# EasyEDA Pro project Complete_project.epro, schematic Schematic2

## Sheets
1 电机: Board Name: control; Create Date: 2024-11-13; Page Name: 电机; Project Name: 煮茶机; Schematic Name: Schematic2; Update Date: 2024-12-08; Company: 嘉立创EDA; Page Size: A4; Version: V1.0
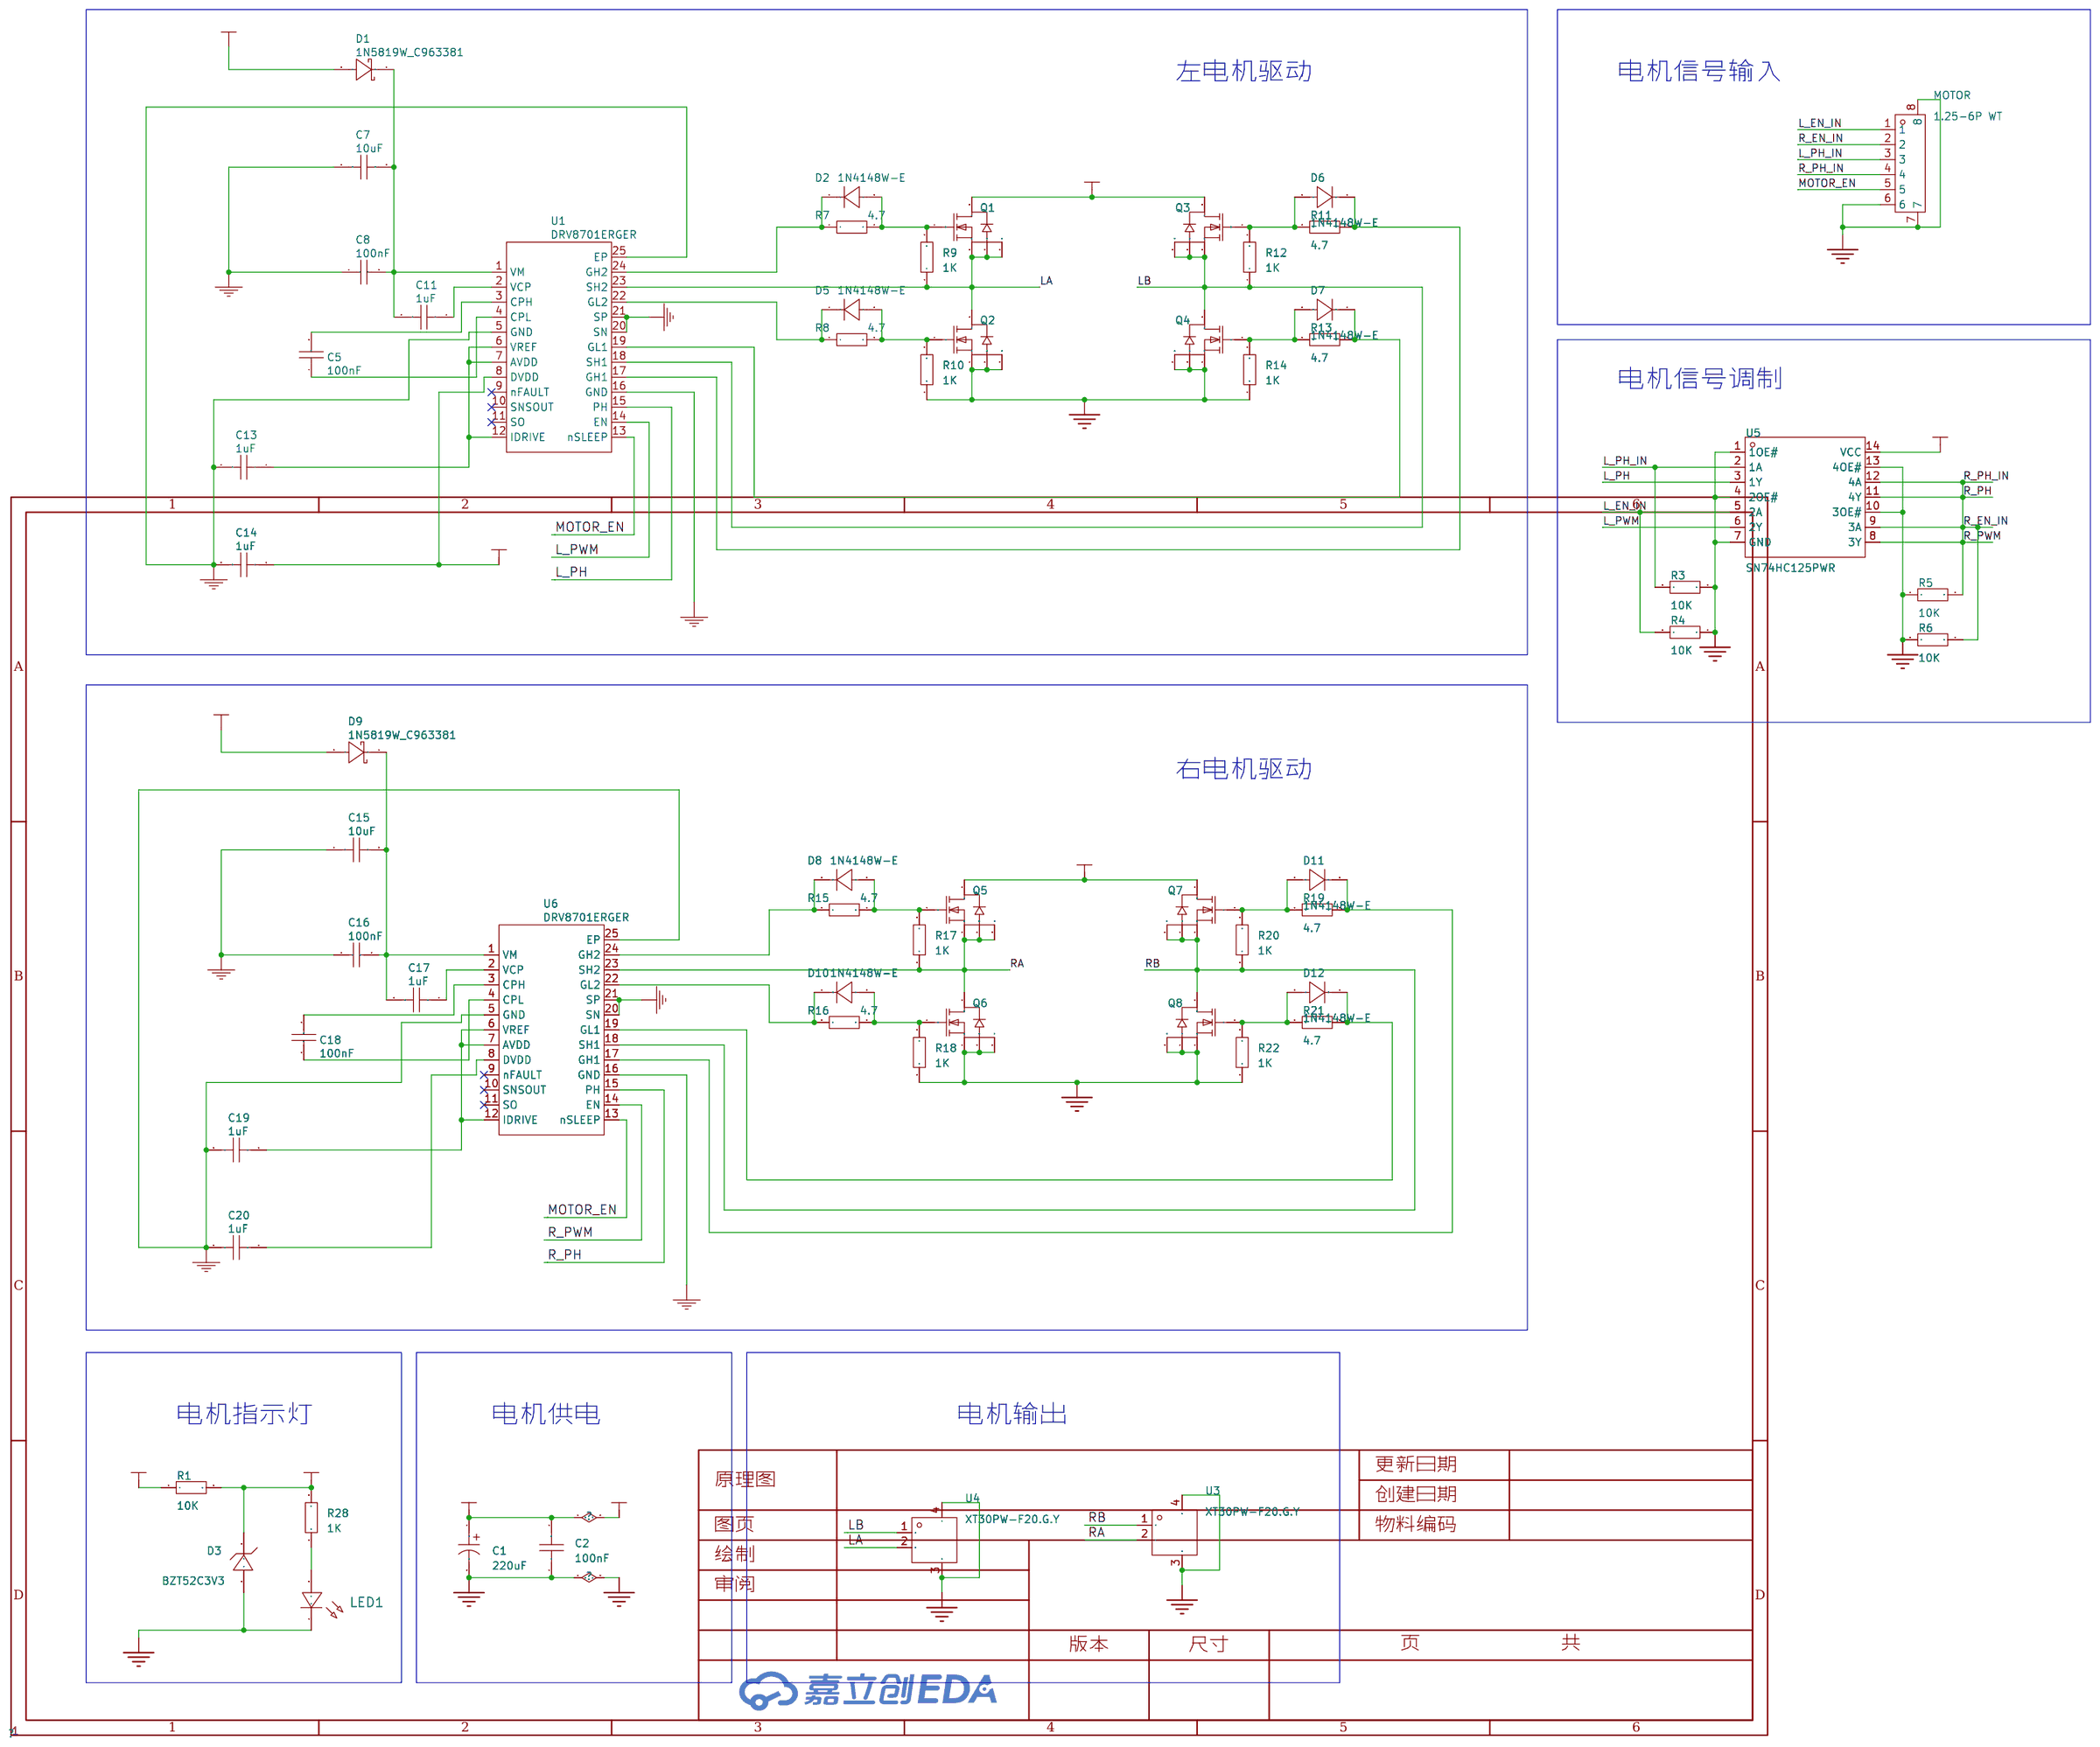
[diagram p2: 电机]
2 其他控制: Create Date: 2024-12-05; Page Name: 其他控制
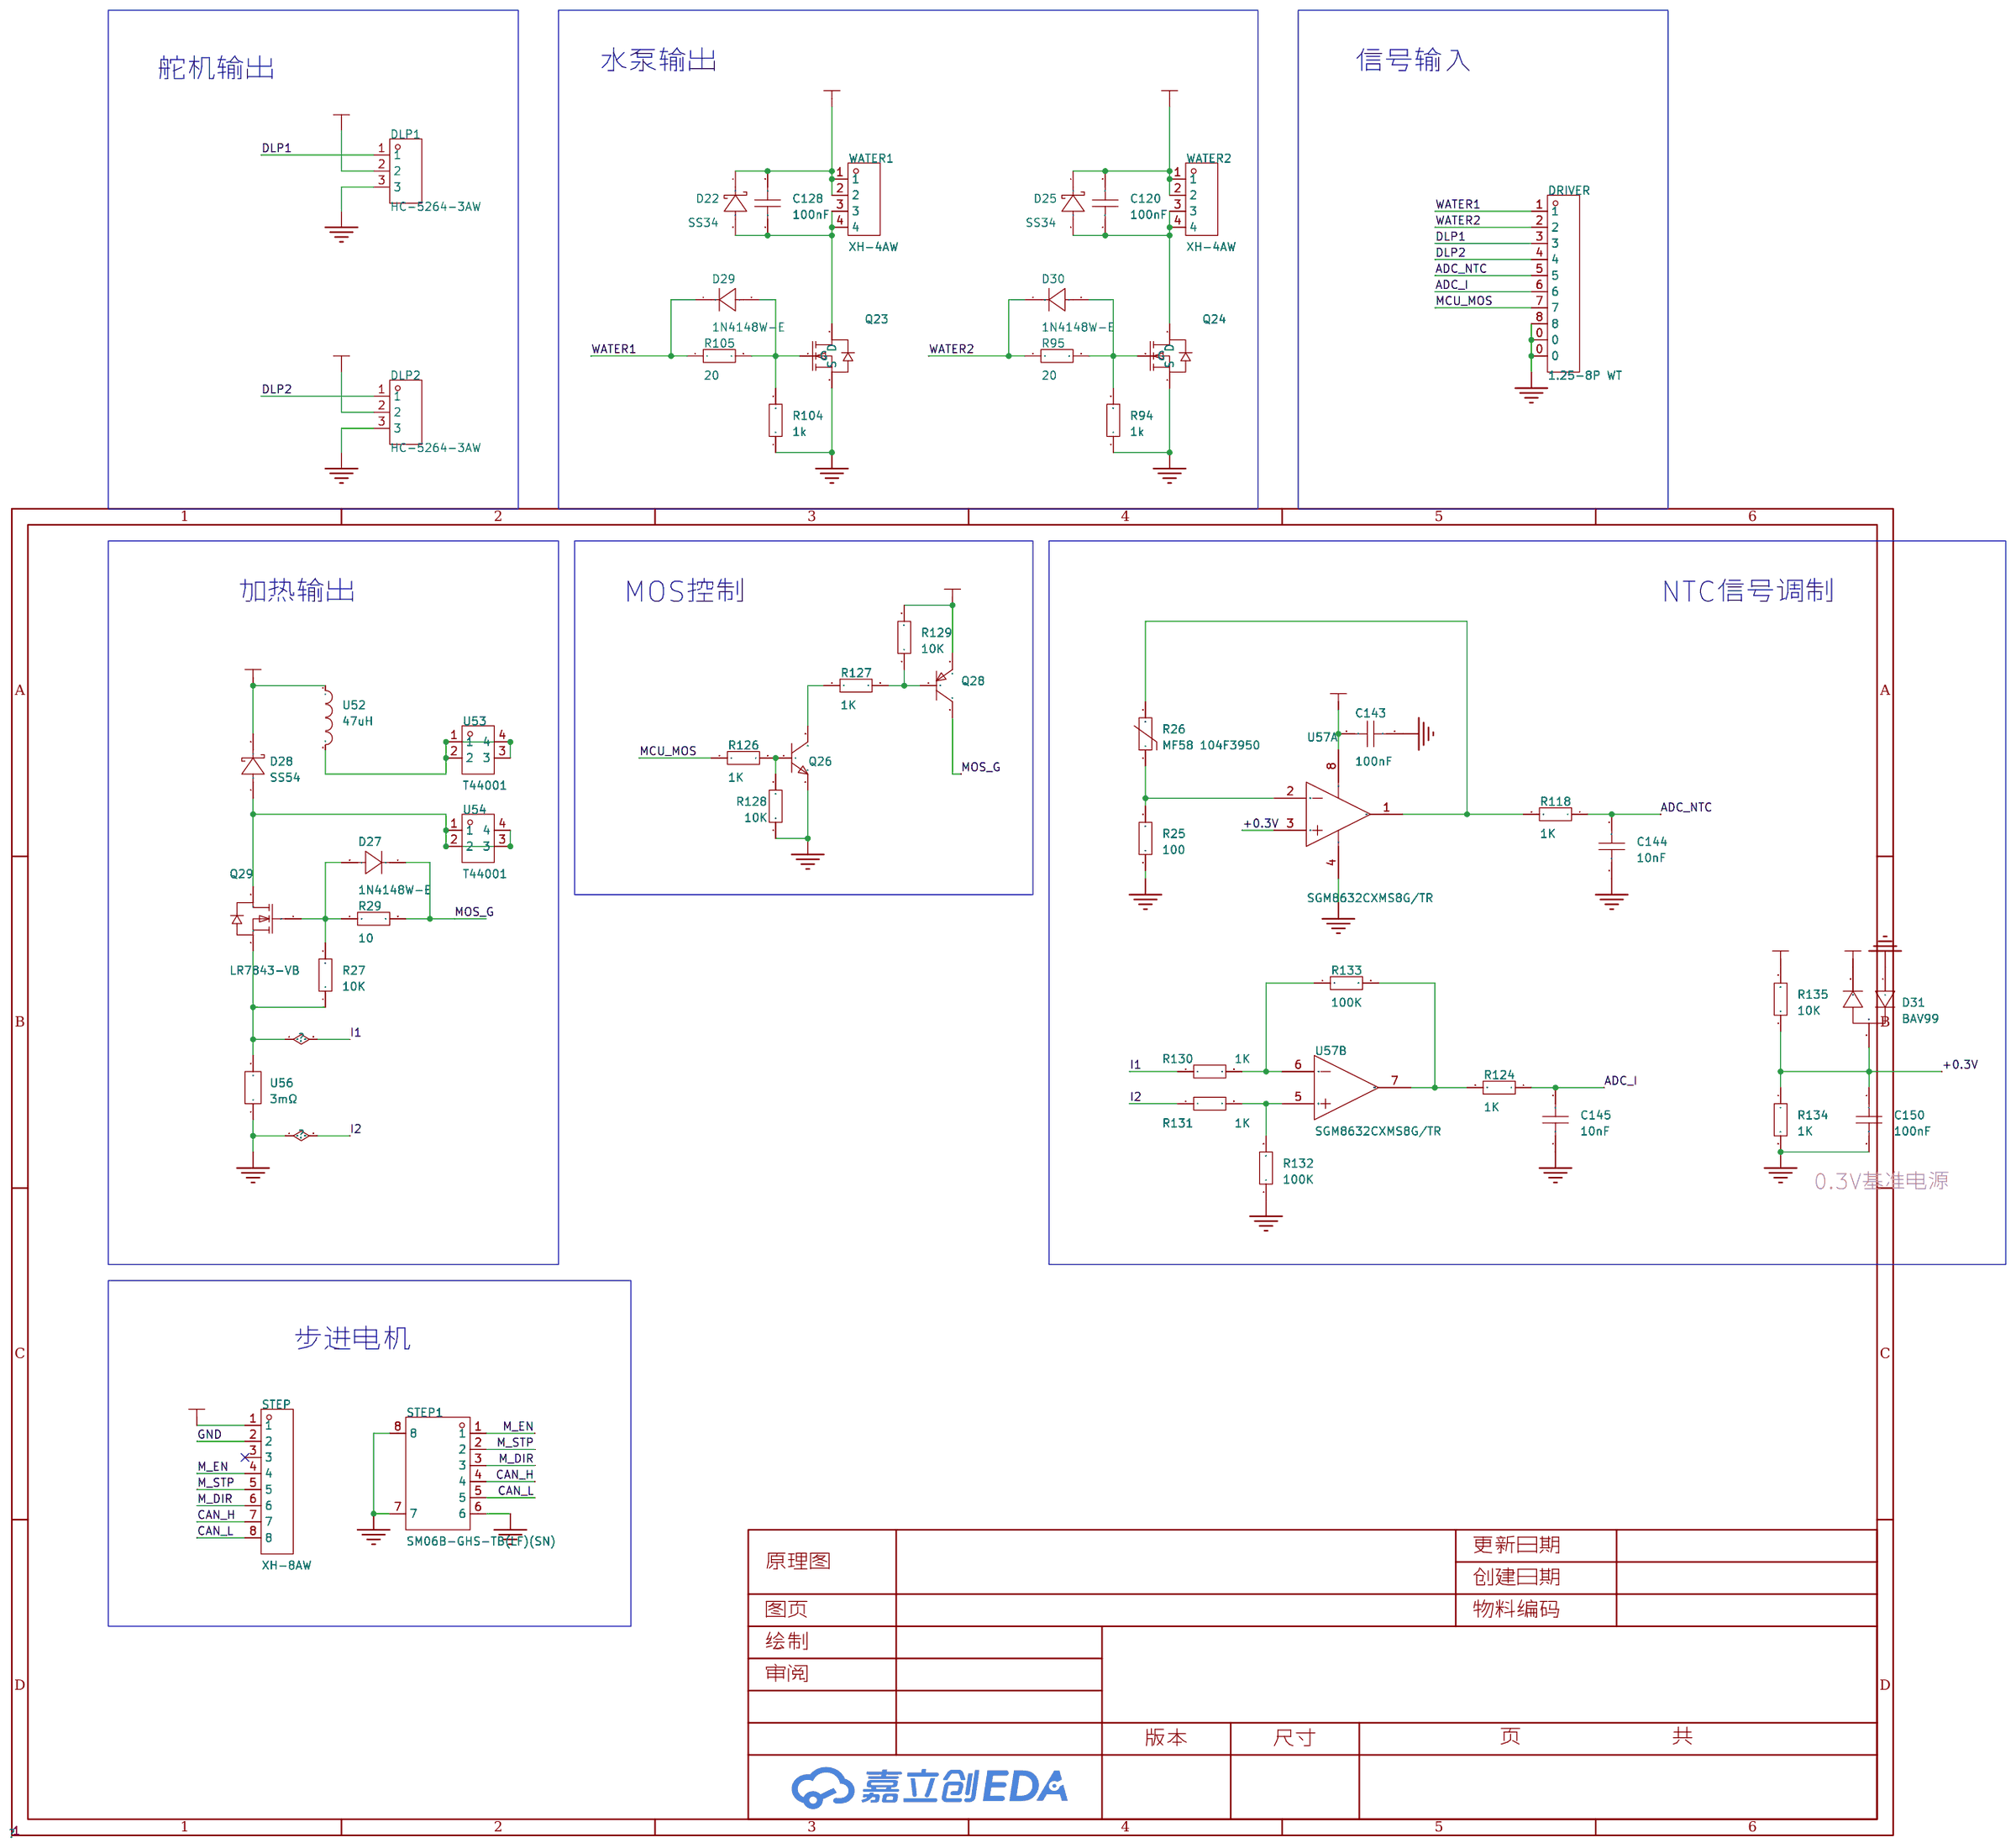
[diagram p3: 其他控制]
3 电源管理: Create Date: 2024-12-05; Page Name: 电源管理; Update Date: 2025-02-22
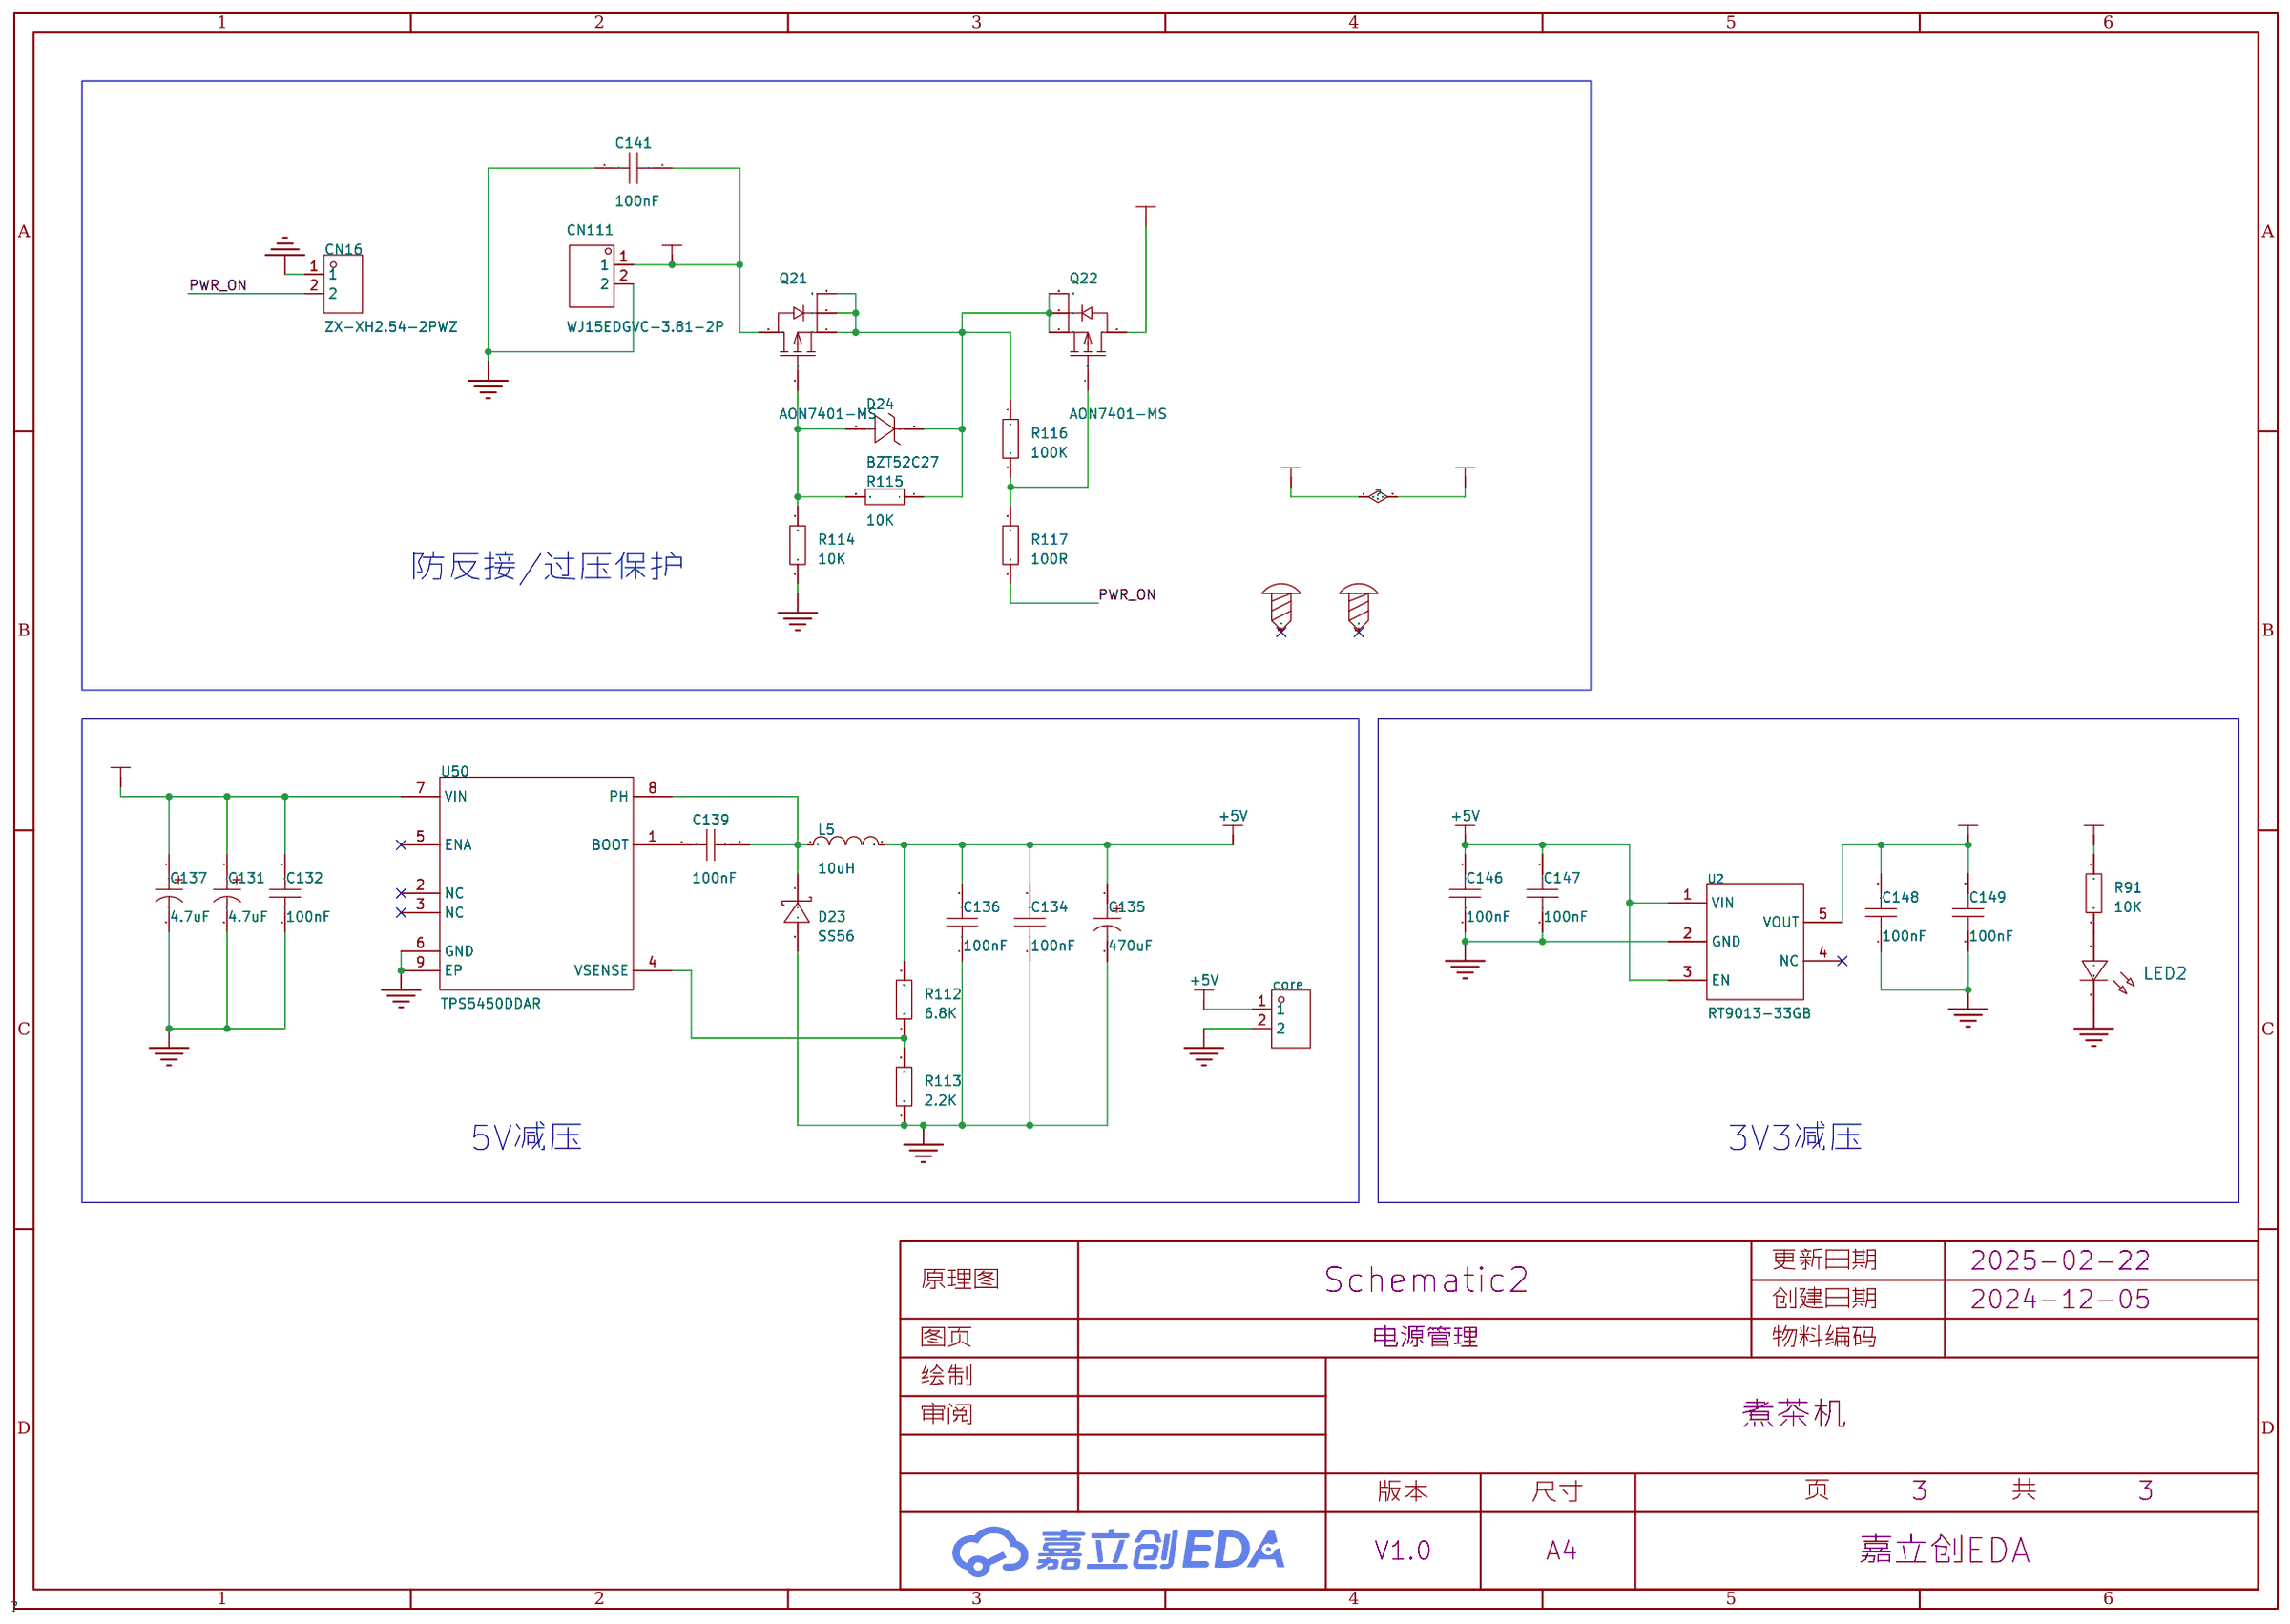
[diagram p4: 电源管理]

## Parts
sheet 其他控制
C120  100nF  [C0805]
C128  100nF  [C0805]
C143  100nF  [C0805]
C144  10nF  [C0805]
C145  10nF  [C0805]
C150  100nF  [C0805]
D22  SS34  [SMA_L4.3-W2.5-LS5.0-RD]
D25  SS34  [SMA_L4.3-W2.5-LS5.0-RD]
D27  1N4148W-E  [SOD-123_L2.8-W1.6-LS3.7-RD]
D28  SS54  [SMA_L4.3-W2.6-LS5.0-FD]
D29  1N4148W-E  [SOD-123_L2.8-W1.6-LS3.7-RD]
D30  1N4148W-E  [SOD-123_L2.8-W1.6-LS3.7-RD]
D31  BAV99  [SOT-23_L2.9-W1.3-P1.90-LS2.4-BR]
DLP1  HC-5264-3AW  [CONN-TH_3P-P2.50_HCTL_HC-5264-3AW]
DLP2  HC-5264-3AW  [CONN-TH_3P-P2.50_HCTL_HC-5264-3AW]
DRIVER  1.25-8P WT  [CONN-SMD_8P-P1.25-L4.4-W14.8]
Q23  -  [SOT-23-3_L2.9-W1.3-P1.90-LS2.4-BR]
Q24  -  [SOT-23-3_L2.9-W1.3-P1.90-LS2.4-BR]
Q26  -  [S8050_SOT-23]
Q28  -  [S8550P_SOT]
Q29  LR7843-VB  [TO-252-2_L6.6-W6.1-P4.58-LS9.9-BR]
R25  100  [R0805]
R26  MF58 104F3950  [RES-TH_BD2.5-L4.7-P8.70-D0.5]
R27  10K  [R0805]
R29  10  [R0805]
R94  1k  [R0805]
R95  20  [R0805]
R104  1k  [R0805]
R105  20  [R0805]
R118  1K  [R0805]
R124  1K  [R0805]
R126  1K  [R0805]
R127  1K  [R0805]
R128  10K  [R0805]
R129  10K  [R0805]
R130  1K  [R0805]
R131  1K  [R0805]
R132  100K  [R0805]
R133  100K  [R0805]
R134  1K  [R0805]
R135  10K  [R0805]
STEP  XH-8AW  [CONN-TH_8P-P2.54_HCTL_XH-8AW_C2908617]
STEP1  SM06B-GHS-TB(LF)(SN)  [CONN-TH_SM06B-GHS-TB-LF-SN]
U52  47uH  [IND-TH_L16.5-W8.5-P11.00-D1.0]
U53  T44001  [CONN-TH_T44001]
U54  T44001  [CONN-TH_T44001]
U56  3mΩ  [R2512]
U57  SGM8632CXMS8G/TR  [MSOP-8_L3.0-W3.0-P0.65-LS4.9-BL]  (sections 1,2)
WATER1  XH-4AW  [CONN-TH_XH-4AW]
WATER2  XH-4AW  [CONN-TH_XH-4AW]
sheet 电机
C1  220uF  [CAP-TH_BD6.3-P2.50-D1.0-FD]
C2  100nF  [C0805]
C5  100nF  [C0603]
C7  10uF  [C0603]
C8  100nF  [C0603]
C11  1uF  [C0603]
C13  1uF  [C0603]
C14  1uF  [C0603]
C15  10uF  [C0603]
C16  100nF  [C0603]
C17  1uF  [C0603]
C18  100nF  [C0603]
C19  1uF  [C0603]
C20  1uF  [C0603]
D1  1N5819W_C963381  [SOD-123_L2.7-W1.6-LS3.7-RD]
D2  1N4148W-E  [SOD-123_L2.8-W1.6-LS3.7-RD]
D3  BZT52C3V3  [SOD-123_L2.7-W1.6-LS3.7-RD]
D5  1N4148W-E  [SOD-123_L2.8-W1.6-LS3.7-RD]
D6  1N4148W-E  [SOD-123_L2.8-W1.6-LS3.7-RD]
D7  1N4148W-E  [SOD-123_L2.8-W1.6-LS3.7-RD]
D8  1N4148W-E  [SOD-123_L2.8-W1.6-LS3.7-RD]
D9  1N5819W_C963381  [SOD-123_L2.7-W1.6-LS3.7-RD]
D10  1N4148W-E  [SOD-123_L2.8-W1.6-LS3.7-RD]
D11  1N4148W-E  [SOD-123_L2.8-W1.6-LS3.7-RD]
D12  1N4148W-E  [SOD-123_L2.8-W1.6-LS3.7-RD]
LED1  -  [LED_0805]
MOTOR  1.25-6P WT  [CONN-SMD_1.25-6PWT]
Q1  CSD18540Q5B(TOKMAS)  [TDSON-8_L5.9-W5.2-P1.27-BL]
Q2  CSD18540Q5B(TOKMAS)  [TDSON-8_L5.9-W5.2-P1.27-BL]
Q3  CSD18540Q5B(TOKMAS)  [TDSON-8_L5.9-W5.2-P1.27-BL]
Q4  CSD18540Q5B(TOKMAS)  [TDSON-8_L5.9-W5.2-P1.27-BL]
Q5  CSD18540Q5B(TOKMAS)  [TDSON-8_L5.9-W5.2-P1.27-BL]
Q6  CSD18540Q5B(TOKMAS)  [TDSON-8_L5.9-W5.2-P1.27-BL]
Q7  CSD18540Q5B(TOKMAS)  [TDSON-8_L5.9-W5.2-P1.27-BL]
Q8  CSD18540Q5B(TOKMAS)  [TDSON-8_L5.9-W5.2-P1.27-BL]
R1  10K  [R0805]
R3  10K  [R0805]
R4  10K  [R0805]
R5  10K  [R0805]
R6  10K  [R0805]
R7  4.7  [R0805]
R8  4.7  [R0805]
R9  1K  [R0805]
R10  1K  [R0805]
R11  4.7  [R0805]
R12  1K  [R0805]
R13  4.7  [R0805]
R14  1K  [R0805]
R15  4.7  [R0805]
R16  4.7  [R0805]
R17  1K  [R0805]
R18  1K  [R0805]
R19  4.7  [R0805]
R20  1K  [R0805]
R21  4.7  [R0805]
R22  1K  [R0805]
R28  1K  [R0805]
U1  DRV8701ERGER  [VQFN-24_L4.0-W4.0-P0.50-BL-EP2.8]
U3  XT30PW-F20.G.Y  [CONN-TH_XT30PW-F-1]
U4  XT30PW-F20.G.Y  [CONN-TH_XT30PW-F-1]
U5  SN74HC125PWR  [TSSOP-14_L5.0-W4.4-P0.65-LS6.5-BL]
U6  DRV8701ERGER  [VQFN-24_L4.0-W4.0-P0.50-BL-EP2.8]
sheet 电源管理
C131  4.7uF  [CAP-SMD_BD4.0-L4.3-W4.3-LS5.0-FD]
C132  100nF  [C0805]
C134  100nF  [C0805]
C135  470uF  [CAP-SMD_BD10.0-L10.3-W10.3-LS11.3-FD]
C136  100nF  [C0805]
C137  4.7uF  [CAP-SMD_BD4.0-L4.3-W4.3-LS5.0-FD]
C139  100nF  [C0805]
C141  100nF  [C1210]
C146  100nF  [C0805]
C147  100nF  [C0805]
C148  100nF  [C0805]
C149  100nF  [C0805]
CN16  ZX-XH2.54-2PWZ  [CONN-TH_2P-P2.50_ZX-XH2.54-2PWZ]
CN111  WJ15EDGVC-3.81-2P  [CONN-TH_WJ15EDGVC-3.81-2P]
core  ZX-XH2.54-2PWZ  [CONN-TH_2P-P2.50_ZX-XH2.54-2PWZ]
D23  SS56  [SMA_L4.3-W2.6-LS5.2-RD]
D24  BZT52C27  [SOD-123_L2.7-W1.6-LS3.7-RD]
L5  10uH  [IND-SMD_L7.3-W6.8]
LED2  -  [LED_0805]
Q21  AON7401-MS  [POWERDI3333-8_DMN7022LFGQ-7]
Q22  AON7401-MS  [POWERDI3333-8_DMN7022LFGQ-7]
R91  10K  [R0805]
R112  6.8K  [R0805]
R113  2.2K  [R0805]
R114  10K  [R0805]
R115  10K  [R0805]
R116  100K  [R0805]
R117  100R  [R0805]
SCREW1  -  [M3螺丝]
SCREW2  -  [M3螺丝]
U2  RT9013-33GB  [SOT-23-5_L3.0-W1.7-P0.95-LS2.8-BL]
U50  TPS5450DDAR  [SOP-8_L4.9-W3.9-P1.27-LS6.0-BL-EP]

## Library data of the parts
C2 C120 C128 C132 C134 C136 C139 C141 C143-C150 = CAP_0805: Supplier Footprint: 0805
D22 D25 = SS34_C727060: 二极管配置:独立式;正向压降(Vf):550mV@3A;直流反向耐压(Vr):40V;平均整流电流(Io):3A;; LCSC Part Name: 电压:40V 电流:3A; Supplier Part: C727060; Manufacturer: TWGMC(台湾迪嘉); Supplier Footprint: SMA(DO-214AC); JLCPCB Part Class: 扩展库; Datasheet: https://atta.szlcsc.com/upload/public/pdf/source/20200828/C727059_6599B6CAC5F3238B9C33E46794659DBE.pdf; Supplier: LCSC; Diode Configuration: 独立式; Forward Voltage (Vf@If): 550mV@3A; Reverse Voltage (Vr): 40V; Average Rectified Current (Io): 3A; Reverse Leakage Current (Ir): 500uA@40V
D2 D5-D8 D10-D12 D27 D29 D30 = 1N4148W-E: 二极管配置:-;正向压降(Vf):-;直流反向耐压(Vr):-;; LCSC Part Name: 开关二极管; Supplier Part: C41371420; Manufacturer: MDD(辰达半导体); Supplier Footprint: SOD-123; JLCPCB Part Class: 扩展库; Datasheet: https://atta.szlcsc.com/upload/public/pdf/source/20240830/DACFAB1CEFECD76C0C0B0085B83E27DC.pdf; Supplier: LCSC
D28 = SS54_C7420369: 二极管配置:独立式;正向压降(Vf):550mV@5.0A;直流反向耐压(Vr):40V;整流电流:5A;; LCSC Part Name: 电压:40V 电流:5A; Supplier Part: C7420369; Manufacturer: 宏迦橙; Supplier Footprint: SMA(DO-214AC); JLCPCB Part Class: 扩展库; Datasheet: https://atta.szlcsc.com/upload/public/pdf/source/20230828/254C3882F8647358AD9F60DD73611B5E.pdf; Supplier: LCSC; Diode Configuration: 独立式; Forward Voltage (Vf@If): 550mV@5.0A; Reverse Voltage (Vr): 40V; Rectified Current: 5A; Reverse Leakage Current (Ir): 50uA@40V
D31 = BAV99_C408392: 二极管配置:1对串联式;正向压降(Vf):1.25V@150mA;直流反向耐压(Vr):70V;整流电流:200mA;反向恢复时间(trr):6ns;; LCSC Part Name: 电压:70V 电流:200mA; Supplier Part: C408392; Manufacturer: MDD(辰达半导体); Supplier Footprint: SOT-23; JLCPCB Part Class: 扩展库; Datasheet: https://atta.szlcsc.com/upload/public/pdf/source/20240710/712A41600A6652723ABF2FD56C16FE3C.pdf; Supplier: LCSC; Diode Configuration: 1对串联式; Forward Voltage (Vf@If): 1.25V@150mA; Reverse Voltage (Vr): 70V; Rectified Current: 200mA; Reverse Leakage Current: 2.5uA@70V; Reverse Recovery Time (trr): 6ns
DLP1 DLP2 = HC-5264-3AW: 插针结构:1x3P;间距:2.5mm;安装方式:弯插;参考系列:-;总PIN数:3P;排数:1;每排PIN数:3;行距:-;额定电流:3A;触头材质:黄铜;触头镀层:锡;工作温度范围:-25℃~+85℃;; LCSC Part Name: 1x3P 间距:2.5mm 弯插; Supplier Part: C2845826; Manufacturer: HCTL(华灿天禄); Supplier Footprint: 弯插,P=2.5mm; JLCPCB Part Class: 扩展库; Datasheet: https://atta.szlcsc.com/upload/public/pdf/source/20231019/7C36622803850C43F3C11A8612AA539D.pdf; Supplier: LCSC; Pins Structure: 1x3P; Pitch: 2.5mm; Mounting Style: 弯插; Number of Pins: 3P; Number of Rows: 1; Number of PINs Per Row: 3; Current Rating (Max): 3A; Contact Material: 黄铜; Contact Plating: 锡; Operating Temperature Range: -25℃~+85℃
DRIVER = 1.25-8P WT: 插针结构:1x8P;间距:1.25mm;安装方式:卧贴;参考系列:-;总PIN数:8P;排数:1;每排PIN数:8;行距:-;额定电流:-;工作温度范围:-40℃~+85℃;; Supplier Part: C2681529; Manufacturer: SHOU HAN(首韩); Supplier Footprint: SMD,P=1.25mm,卧贴; JLCPCB Part Class: 扩展库; Datasheet: https://atta.szlcsc.com/upload/public/pdf/source/20210107/C2681529_22D70B53821B9BA4D70344DBAB526F9C.pdf; Supplier: LCSC; Pins Structure: 1x8P; Pitch: 1.25mm; Mounting Style: 卧贴; Number of Pins: 8P; Number of Rows: 1; Number of PINs Per Row: 8; Operating Temperature Range: -40℃~+85℃
Q23 Q24 = AO3400A_N: 类型:N沟道;漏源电压(Vdss):30V;连续漏极电流(Id):5.2A;功率(Pd):1W;导通电阻(RDS(on)@Vgs,Id):35mΩ@10V,5A;阈值电压(Vgs(th)@Id):1.5V@250μA;; Supplier Footprint: SOT-23; Supplier Part: C700953
Q26 = S8050_SOT_NPN: Supplier Footprint: SOT-23
Q28 = S8550_SOT_PNP: Supplier Footprint: SOT-23
Q29 = LR7843-VB: 类型:1个N沟道;漏源电压(Vdss):30V;连续漏极电流(Id):35.8A;导通电阻(RDS(on)@Vgs,Id):2.3mΩ@10V,38.8A;功率(Pd):3.75W;阈值电压(Vgs(th)@Id):1.5V@250uA;; LCSC Part Name: 1个N沟道 耐压:30V 电流:120A; Supplier Part: C5137375; Manufacturer: VBsemi(微碧半导体); Supplier Footprint: TO-252; JLCPCB Part Class: 扩展库; Datasheet: https://atta.szlcsc.com/upload/public/pdf/source/20240814/AEBBAF20133735F24F8E0E251780DEE5.pdf; Supplier: LCSC; Type: 1个N沟道; Drain Source Voltage (Vdss): 30V; Continuous Drain Current (Id): 35.8A; Drain Source On Resistance (RDS(on)@Vgs,Id): 2.3mΩ@10V,38.8A; Power Dissipation (Pd): 3.75W; Gate Threshold Voltage (Vgs(th)@Id): 1.5V@250uA; Total Gate Charge (Qg@Vgs): 81.5nC@10V; Input Capacitance (Ciss@Vds): 6.201nF@15V; Reverse Transfer Capacitance (Crss@Vds): 970pF@15V; Operating Temperature: -55℃~+175℃
R1 R3-R22 R25 R27 R29 R91 R94 R95 R104 R105 R112-R118 R124 R126-R135 = Res_0805: Supplier Footprint: 0805
R26 = MF58 104F3950: 阻值(25℃):100kΩ;B值(25℃/50℃):3950K;电阻精度:±1%;功率:50mW;B值精度:±1%;最大稳态电流(25℃):-;; LCSC Part Name: 100kΩ 电阻精度:±1% 3950K; Supplier Part: C123399; Manufacturer: 时恒; Supplier Footprint: 插件,D1.8xL4mm; JLCPCB Part Class: 扩展库; Datasheet: https://atta.szlcsc.com/upload/public/pdf/source/20170728/C123399_1501225831676848963.pdf; Supplier: LCSC; Resistance @ 25℃: 100kΩ; B Constant (25℃/50℃): 3950K; Resistance Tolerance: ±1%; Power: 50mW; B Constant Tolerance: ±1%; Operating Temperature: -55℃~+250℃
STEP = XH-8AW: 插针结构:1x8P;间距:2.5mm;安装方式:弯插;参考系列:XH;总PIN数:8P;排数:1;每排PIN数:8;行距:-;额定电流:3A;触头材质:黄铜;触头镀层:锡;工作温度范围:-25℃~+85℃;; LCSC Part Name: 1x8P 间距:2.5mm 弯插 系列:XH; Supplier Part: C2908617; Manufacturer: HCTL(华灿天禄); Supplier Footprint: 弯插,P=2.5mm; JLCPCB Part Class: 扩展库; Datasheet: https://atta.szlcsc.com/upload/public/pdf/source/20230711/B565BAF3B11666EF6B81B3605408F2BD.pdf; Supplier: LCSC; Pins Structure: 1x8P; Pitch: 2.5mm; Mounting Style: 弯插; Reference Series: XH; Number of Pins: 8P; Number of Rows: 1; Number of PINs Per Row: 8; Current Rating (Max): 3A; Contact Material: 黄铜; Contact Plating: 锡; Operating Temperature Range: -25℃~+85℃
STEP1 = SM06B-GHS-TB(LF)(SN): 插针结构:1x6P;间距:1.25mm;安装方式:卧贴;参考系列:GH;总PIN数:6P;排数:1;每排PIN数:6;行距:-;额定电流:1A;触头材质:磷青铜;触头镀层:锡;工作温度范围:-25℃~+85℃;; LCSC Part Name: 1x6P 间距:1.25mm 卧贴 系列:GH; Supplier Part: C133065; Manufacturer: JST; Supplier Footprint: SMD,P=1.25mm,卧贴; JLCPCB Part Class: 扩展库; Datasheet: https://atta.szlcsc.com/upload/public/pdf/source/20180323/112205B2CF875947C9562BFC7B01FA26.pdf; Supplier: LCSC; Pins Structure: 1x6P; Pitch: 1.25mm; Mounting Style: 卧贴; Reference Series: GH; Number of Pins: 6P; Number of Rows: 1; Number of PINs Per Row: 6; Current Rating (Max): 1A; Contact Material: 磷青铜; Contact Plating: 锡; Operating Temperature Range: -25℃~+85℃; Rated Voltage (Max): 50V; Plastic Material: PA9T; Flame Retardant Rating: UL94V-0; Supplementary Features: 辅助焊脚; Colour: 白色; Z-Height of the Board: 4.25mm; X-Length of Bottom Edge on Board (Spacing Line): 10.75mm; Y-Width of Bottom Edge on Board: 4.13mm
U52 = SLT050125T470MUB: 电感值:47uH;精度:±20%;额定电流:3.5A;饱和电流(Isat):-;类型:磁环电感;Q值:-;; LCSC Part Name: 47uH ±20% 磁环电感; Supplier Part: C326012; Manufacturer: Sunltech(韩国顺磁); Supplier Footprint: 插件; JLCPCB Part Class: 扩展库; Datasheet: https://atta.szlcsc.com/upload/public/pdf/source/20181123/C326012_AA1DF0CD47BA5A6C3143C7272DE12C51.pdf; Supplier: LCSC; Tolerance: ±20%; Rated Current: 3.5A; DC Resistance: 38mΩ; Type: 磁环电感; Wire Diameter: 0.7mm
U53 U54 = T44001: 外观形状:板凳状;螺孔规格:M4;焊脚数量:4;焊脚间距(相邻):-;本体高度:-;额定电流:-;本体材质:-;本体镀层:-;工作温度:-;; LCSC Part Name: 四脚 M4 2件套; Supplier Part: C481447; Manufacturer: XFCN(兴飞); Supplier Footprint: 插件; JLCPCB Part Class: 扩展库; Datasheet: https://atta.szlcsc.com/upload/public/pdf/source/20241113/DBD34B45AB5A92804F3251B4AEFB1CE3.pdf; Supplier: LCSC; appearance and shape: 板凳状; Screw Hole Size: M4; Number of Leg: 4; Connectable Bits: 1; Direction of Connection: 顶部
U56 = HoYLR2512-3W-3mR-1%: 电阻类型:采样电阻;阻值:3mΩ;精度:±1%;功率:3W;安装方式:贴片;; LCSC Part Name: 3mΩ ±1% 3W; Supplier Part: C5375459; Manufacturer: Milliohm(毫欧); Supplier Footprint: 2512; JLCPCB Part Class: 扩展库; Datasheet: https://atta.szlcsc.com/upload/public/pdf/source/20230410/281FB57F2A31C64FD07DBC5FCC932F0E.pdf; Supplier: LCSC; Type: 采样电阻; Tolerance: ±1%; Power(Watts): 3W; Mounting Sytle: 贴片
U57 = SGM8632CXMS8G/TR: Supplier Part: C5152235; Manufacturer: SGMICRO(圣邦微); Supplier Footprint: MSOP-8; JLCPCB Part Class: 扩展库; Datasheet: https://atta.szlcsc.com/upload/public/pdf/source/20230206/ADD1FC9CEA692601AE4CB770574F6022.pdf; Supplier: LCSC
WATER1 WATER2 = XH-4AW: 插针结构:1x4P;间距:2.54mm;安装方式:弯插;参考系列:XH;总PIN数:4P;排数:1;每排PIN数:4;行距:-;额定电流:3A;触头材质:黄铜;触头镀层:锡;工作温度范围:-25℃~+85℃;; LCSC Part Name: 1x4P 间距:2.54mm 弯插 系列:XH; Supplier Part: C2908613; Manufacturer: HCTL(华灿天禄); Supplier Footprint: 弯插,P=2.5mm; JLCPCB Part Class: 扩展库; Datasheet: https://atta.szlcsc.com/upload/public/pdf/source/20230711/B565BAF3B11666EF6B81B3605408F2BD.pdf; Supplier: LCSC; Pins Structure: 1x4P; Pitch: 2.54mm; Mounting Style: 弯插; Reference Series: XH; Number of Pins: 4P; Number of Rows: 1; Number of PINs Per Row: 4; Current Rating (Max): 3A; Contact Material: 黄铜; Contact Plating: 锡; Operating Temperature Range: -25℃~+85℃
C1 = SPZ1VM221E12O00RAXXX: 容值:220uF;精度:±20%;额定电压:35V;纹波电流:2.7A@100kHz;等效串联电阻:30mΩ@100kHz;类型:-;; LCSC Part Name: 220uF ±20% 35V; Supplier Part: C171433; Manufacturer: AISHI(艾华集团); Supplier Footprint: 插件,D6.3xL12mm; JLCPCB Part Class: Extended Part; Datasheet: https://atta.szlcsc.com/upload/public/pdf/source/20180111/C171434_15156662769471259234.pdf; Supplier: LCSC; Tolerance: ±20%; Rated Voltage: 35V; Ripple Current: 2.7A@100kHz; Equivalent Series Resistance(ESR): 30mΩ@100kHz; Lead Spacing: 2.5mm; φD: 6.3mm; L: 12mm; Lifetime @ Temp: 2000hrs@105℃; Operating Temperature: -55℃~+105℃
C5 C8 C16 C18 = 100nF: Supplier: LCSC; Manufacturer: WTC; Manufacturer Part: 0603F104M500; Supplier Part: C94073; JLCPCB Part Class: Extended Part
C7 C15 = 10uF: Supplier: LCSC; Manufacturer: WTC; Manufacturer Part: 0603X106M100; Supplier Part: C89283; JLCPCB Part Class: Extended Part
C11 C13 C14 C17 C19 C20 = 1uF: Supplier: LCSC; Supplier Part: C388003; Manufacturer: Walsin Tech Corp; Manufacturer Part: 0603B105K500CT; JLCPCB Part Class: Extended Part
D1 D9 = 1N5819W_C963381: Supplier: LCSC; Supplier Part: C963381; Manufacturer: JSMSEMI(杰盛微); Manufacturer Part: 1N5819W; JLCPCB Part Class: Extended Part
D3 = BZT52C3V3_C173413: 二极管配置:独立式;稳压值(标称值):3.3V;稳压值(范围):3.1V~3.5V;功率:500mW;精度:-;; Supplier Part: C173413; Manufacturer: MDD; Supplier Footprint: SOD-123; JLCPCB Part Class: 扩展库; Datasheet: https://atta.szlcsc.com/upload/public/pdf/source/20230823/A46C7C97908205398E4407DE202CED03.pdf; Supplier: LCSC; Diode Configuration: 独立式; Zener Voltage (Nom): 3.3V; Reverse Leakage Current (Ir): 5uA@1V; Zener Voltage (Range): 3.1V~3.5V; Power Dissipation: 500mW; Zener Impedance (Zzt): 95Ω
LED1 LED2 = LED_0805-R: Supplier Footprint: 0805
MOTOR = 1.25-6P WT: 插针结构:1x6P;间距:1.25mm;安装方式:卧贴;参考系列:-;总PIN数:6P;排数:1;每排PIN数:6;行距:-;额定电流:1A;工作温度范围:-25℃~+85℃;; LCSC Part Name: 1x6P 间距:1.25mm 卧贴; Supplier Part: C668617; Manufacturer: SHOU HAN(首韩); Supplier Footprint: SMD,P=1.25mm,卧贴; JLCPCB Part Class: 扩展库; Datasheet: https://atta.szlcsc.com/upload/public/pdf/source/20200618/C668617_2618E8037EA4B5DDA2614CE7F66138E1.pdf; Supplier: LCSC; Pins Structure: 1x6P; Pitch: 1.25mm; Mounting Style: 卧贴; Number of Pins: 6P; Number of Rows: 1; Number of PINs Per Row: 6; Current Rating (Max): 1A; Operating Temperature Range: -25℃~+85℃
Q1-Q8 = CSD18540Q5B(TOKMAS): 类型:1个N沟道;漏源电压(Vdss):60V;连续漏极电流(Id):200A;导通电阻(RDS(on)@Vgs,Id):2.3mΩ;功率(Pd):132W;; LCSC Part Name: 1个N沟道 耐压:60V 电流:200A; Supplier Part: C19626234; Manufacturer: Tokmas(托克马斯); Supplier Footprint: DFN-8(5x6); JLCPCB Part Class: 扩展库; Datasheet: https://atta.szlcsc.com/upload/public/pdf/source/20231208/6906E27DFF30F6153115656ACF0DBA8B.pdf; Supplier: LCSC; Type: 1个N沟道; Drain Source Voltage (Vdss): 60V; Continuous Drain Current (Id): 200A; Drain Source On Resistance (RDS(on)@Vgs,Id): 2.3mΩ; Power Dissipation (Pd): 132W
R28 = Res_0603: Supplier Footprint: 0603
U1 U6 = DRV8701ERGER: Supplier: LCSC; Supplier Part: C90964; Manufacturer: Texas Instruments; JLCPCB Part Class: Extended Part
U3 U4 = XT30PW-F20.G.Y: 类别:-;类型1:-;; LCSC Part Name: AMASS(艾迈斯)电源连接器 母头 XT30PW-F; Supplier Part: C2913282; Manufacturer: AMASS(艾迈斯); JLCPCB Part Class: 扩展库; Datasheet: https://atta.szlcsc.com/upload/public/pdf/source/20231218/06CFCF98887A9A87638B0856A725C8FD.pdf; Supplier: LCSC; Type: 航模插头; InterfaceType: 母头
U5 = SN74HC125PWR: 输入类型:-;电源电压:2V~6V;元件数:4;每个元件位数:1;灌电流(IOL):7.8mA;拉电流(IOH):7.8mA;; Supplier Part: C132994; Manufacturer: TI(德州仪器); Supplier Footprint: TSSOP-14; JLCPCB Part Class: 扩展库; Datasheet: https://www.ti.com/cn/lit/gpn/sn74hc125; Supplier: LCSC; output type: 三态; Supply Voltage: 2V~6V; Number of Elements: 4; Number of Bits per Element: 1; Sink Current: 7.8mA; Source Current: 7.8mA; Logic Family: 74HC; Operating Temperature: -40℃~+85℃
C131 C137 = VT4.7UF50V167RV0133: 容值:4.7uF;精度:±20%;额定电压:50V;纹波电流:15mA@120Hz;等效串联电阻:-;; LCSC Part Name: 4.7uF ±20% 50V; Supplier Part: C5246584; Manufacturer: KNSCHA(科尼盛); Supplier Footprint: SMD,D4xL5.4mm; JLCPCB Part Class: 扩展库; Datasheet: https://atta.szlcsc.com/upload/public/pdf/source/20221104/28D100275C90741A69E4DC1F6F9A3749.pdf; Supplier: LCSC; Tolerance: ±20%; Rated Voltage: 50V; Ripple Current: 15mA@120Hz; φD: 4mm; L: 5.4mm; Lifetime @ Temp: 2000hrs@105℃; Operating Temperature: -55℃~+105℃
C135 = RVT1E471M1010 470UF 25V: 容值:470uF;精度:±20%;额定电压:25V;纹波电流:286mA@120Hz;等效串联电阻:-;; LCSC Part Name: 470uF ±20% 25V; Supplier Part: C970707; Manufacturer: DMBJ(振宝佳); Supplier Footprint: SMD,D10xL10.2mm; JLCPCB Part Class: Extended Part; Datasheet: https://atta.szlcsc.com/upload/public/pdf/source/20201217/C970594_282EC4D70669AEE33806F6C24A5FAA0B.pdf; Supplier: LCSC; Tolerance: ±20%; Rated Voltage: 25V; Ripple Current: 286mA@120Hz; φD: 10mm; L: 10.2mm; Lifetime @ Temp: 2800hrs@105℃; Operating Temperature: -55℃~+105℃
CN16 core = ZX-XH2.54-2PWZ: 插针结构:1x2P;间距:2.54mm;安装方式:弯插;参考系列:XH;总PIN数:2P;排数:1;每排PIN数:2;行距:-;额定电流:3A;触头材质:黄铜;触头镀层:锡;工作温度范围:-25℃~+85℃;; Supplier Part: C7429641; Manufacturer: Megastar(兆星); Supplier Footprint: 弯插,P=2.54mm; JLCPCB Part Class: 扩展库; Datasheet: https://atta.szlcsc.com/upload/public/pdf/source/20230619/56AE8F2E01CDFEAA97FC89B5ED558AB5.pdf; Supplier: LCSC; Pins Structure: 1x2P; Pitch: 2.54mm; Mounting Style: 弯插; Reference Series: XH; Number of Pins: 2P; Number of Rows: 1; Number of PINs Per Row: 2; Current Rating (Max): 3A; Contact Material: 黄铜; Contact Plating: 锡; Operating Temperature Range: -25℃~+85℃
CN111 = WJ15EDGVC-3.81-2P: 连接器类型:板端/插座-闭口;固定方式:-;结构:1x2P;间距:3.81mm;颜色:-;安装方式:直针;排数:1;每排PIN数:2;额定电流:8A;额定电压:300V;线规 - AWG:-;线规 - 平方毫米:-;触头材质:黄铜;触头镀层:锡;工作温度范围:-40℃~+105℃;焊接温度(最大值):-;; LCSC Part Name: 1x2P 3.81mm 排数:1 每排P数:2; Supplier Part: C8396; Manufacturer: KANGNEX(康奈克斯电气); Supplier Footprint: 插件,P=3.81mm; JLCPCB Part Class: 扩展库; Datasheet: https://atta.szlcsc.com/upload/public/pdf/source/20191225/C8396_DFFE6D58C2AF45781C2AF0BF2B733CCC.pdf; Supplier: LCSC; Connector Type: 板端/插座-闭口; Structure: 1x2P; Pitch: 3.81mm; Mounting Style: 直针; Number of Pins: 2P; Number of Rows: 1; Number of PINs Per Row: 2; Current Rating (Max): 8A; Voltage Rating (Max): 300V; Contact Material: 黄铜; Contact Plating: 锡; Operating Temperature Range: -40℃~+105℃
D23 = SS56_C65009: 二极管配置:独立式;正向压降(Vf):700mV@5A;直流反向耐压(Vr):60V;整流电流:5A;; LCSC Part Name: 电压:60V 电流:5A; Supplier Part: C65009; Manufacturer: MDD(辰达半导体); Supplier Footprint: SMA(DO-214AC); JLCPCB Part Class: 扩展库; Datasheet: https://atta.szlcsc.com/upload/public/pdf/source/20230314/529CD85F9B31F69841D3A079BC07E377.pdf; Supplier: LCSC; Diode Configuration: 独立式; Forward Voltage (Vf@If): 700mV@5A; Reverse Voltage (Vr): 60V; Rectified Current: 5A; Reverse Leakage Current (Ir): 1mA@60V
D24 = BZT52C27_C19077417: 二极管配置:独立式;稳压值(标称值):27V;稳压值(范围):25.65V~28.35V;功率(Pd):300mW;; Supplier Part: C19077417; Manufacturer: 宏迦橙; Supplier Footprint: SOD-123; JLCPCB Part Class: 扩展库; Datasheet: https://atta.szlcsc.com/upload/public/pdf/source/20231025/04C236D016943CCCD8EB2CC43C101E31.pdf; Supplier: LCSC; Diode Configuration: 独立式; Zener Voltage (Nom): 27V; Reverse Leakage Current (Ir): 100nA@18.9V; Zener Voltage (Range): 25.65V~28.35V; Power Dissipation: 300mW; Zener Impedance (Zzt): 80Ω
L5 = FXL0630-100-M: 电感值:10uH;精度:±20%;额定电流:4.5A;饱和电流(Isat):5.5A;类型:一体成型电感;; LCSC Part Name: 10uH ±20% 5.5A; Supplier Part: C167223; Manufacturer: cjiang(长江微电); Supplier Footprint: SMD,6.6x7mm; JLCPCB Part Class: 扩展库; Datasheet: https://atta.szlcsc.com/upload/public/pdf/source/20240426/3189EA8206330E2108542F9E34E540E7.pdf; Supplier: LCSC; Tolerance: ±20%; Rated Current: 4.5A; Saturation Current (Isat): 5.5A; DC Resistance (DCR): 68mΩ; Type: 一体成型电感
Q21 Q22 = AON7401-MS: 类型:1个P沟道;漏源电压(Vdss):30V;连续漏极电流(Id):50A;导通电阻(RDS(on)@Vgs,Id):13mΩ@10V;阈值电压(Vgs(th)@Id):2.5V;; LCSC Part Name: 1个P沟道 耐压:30V 电流:50A; Supplier Part: C17702935; Manufacturer: MSKSEMI(美森科); Supplier Footprint: DFN3x3-8L; JLCPCB Part Class: 扩展库; Datasheet: https://atta.szlcsc.com/upload/public/pdf/source/20230927/4A8DE91060F4732D15B0B926858E3411.pdf; Supplier: LCSC; Type: 1个P沟道; Drain Source Voltage (Vdss): 30V; Continuous Drain Current (Id): 50A; Drain Source On Resistance (RDS(on)@Vgs,Id): 13mΩ@10V; Gate Threshold Voltage (Vgs(th)@Id): 2.5V
SCREW1 SCREW2 = M3螺丝: Supplier Footprint: 插件
U2 = RT9013-33GB: 输出类型:固定;输出极性:正;最大输入电压:5.5V;输出电压:3.3V;输出电流:500mA;电源纹波抑制比(PSRR):50dB@(10kHz);; LCSC Part Name: 输入5.5V 输出3.3V 500mA; Supplier Part: C47773; Manufacturer: RICHTEK(立锜); Supplier Footprint: SOT-23-5; JLCPCB Part Class: 扩展库; Datasheet: https://atta.szlcsc.com/upload/public/pdf/source/20150504/1457707282459.pdf; Supplier: LCSC; Output Type: 固定; Output Polarity: 正; Number of Outputs: 1; Maximum Input Voltage: 5.5V; Output Voltage: 3.3V; Dropout Voltage: 400mV@(500mA); Quiescent Current (Ground Current): 50uA; Output Current: 500mA; Power Supply Rejection Ratio (PSRR): 50dB@(10kHz); Operating Temperature: -40℃~+85℃
U50 = TPS5450DDAR: 功能类型:降压型;输出类型:可调;输入电压:5.5V~36V;输出电压:1.221V~31.32V;输出电流(最大值):5A;; Supplier Part: C114425; Manufacturer: TI(德州仪器); Supplier Footprint: SOP-8-EP-150mil; JLCPCB Part Class: 扩展库; Datasheet: https://www.ti.com/cn/lit/gpn/tps5450; Supplier: LCSC; Function: 降压型; Output Type: 可调; Input Voltage: 5.5V~36V; Output Voltage: 1.221V~31.32V; Output Current (Max): 5A; Switching Frequency: 500kHz; Operating Temperature: -40℃~+125℃@(TJ); Synchronous Rectification: 否; Number of Outputs: 1; Topology: 降压式; Switch tube (built-in/external): 内置

## Nets
+0.3V: C150.1 D31.3 R134.1 R135.1 U57.3(INA+)
+3.3V: C143.2 C148.2 C149.2 D3.1(K) D31.2 R1.2 R28.2 R91.2 R135.2 U2.5(VOUT) U57.8(+VS)
+5V: C134.2 C135.1 C136.2 C146.2 C147.2 core.1 DLP1.2 DLP2.2 L5.2 R112.2 U2.1(VIN) U2.3(EN)
+12V: C1.1 C2.2 C120.2 C128.2 C131.1 C132.2 C137.1 D1.2(A) D9.2(A) D22.1(C) D25.1(C) D28.2(K) Q1.5(D) Q3.5(D) Q5.5(D) Q7.5(D) Q22.5(D) Q28.2(E) R1.1 R129.2 STEP.1 U50.7(VIN) U52.1 WATER1.1 WATER1.2 WATER2.1 WATER2.2
DVDD: C14.1 U1.8(DVDD) U5.14(VCC)
GND: C1.2 C2.1 C7.1 C8.1 C13.2 C14.2 C15.1 C16.1 C19.2 C20.2 C131.2 C132.1 C134.1 C135.2 C136.1 C137.2 C141.2 C143.1 C144.1 C145.1 C146.1 C147.1 C148.1 C149.1 C150.2 CN16.1 CN111.2 core.2 D3.2(A) D23.2(A) D31.1 DLP1.3 DLP2.3 DRIVER.0 DRIVER.8 LED1.1(C) LED2.1(C) MOTOR.6 MOTOR.7 MOTOR.8 Q2.1(S) Q2.2(S) Q2.3(S) Q4.1(S) Q4.2(S) Q4.3(S) Q6.1(S) Q6.2(S) Q6.3(S) Q8.1(S) Q8.2(S) Q8.3(S) Q23.2(S) Q24.2(S) Q26.2 R3.1 R4.1 R5.1 R6.1 R10.1 R14.1 R18.1 R22.1 R25.1 R94.1 R104.1 R113.1 R114.1 R128.1 R131.1 R132.1 R134.2 STEP.2 STEP1.6 STEP1.7 STEP1.8 U1.5(GND) U1.16(GND) U1.20(SN) U1.21(SP) U1.25(EP) U2.2(GND) U3.3 U3.4 U4.3 U4.4 U5.1(1OE#) U5.4(2OE#) U5.7(GND) U5.10(3OE#) U5.13(4OE#) U6.5(GND) U6.16(GND) U6.20(SN) U6.21(SP) U6.25(EP) U50.6(GND) U50.9(EP) U56.1 U57.4(-VS)
ADC_I: C145.2 DRIVER.6 R124.1
ADC_NTC: C144.2 DRIVER.5 R118.1
CAN_H: STEP.7 STEP1.4
CAN_L: STEP.8 STEP1.5
DLP1: DLP1.1 DRIVER.3
DLP2: DLP2.1 DRIVER.4
I1: Q29.3(S) R27.1 R130.1 U56.2
INPUT: C141.1 CN111.1 Q21.5(D)
L_EN_IN: MOTOR.1 R4.2 U5.5(2A)
L_PH: U1.15(PH) U5.3(1Y)
L_PH_IN: MOTOR.3 R3.2 U5.2(1A)
L_PWM: U1.14(EN) U5.6(2Y)
LA: Q1.1(S) Q1.2(S) Q1.3(S) Q2.5(D) R9.1 U1.23(SH2) U4.2
LB: Q3.1(S) Q3.2(S) Q3.3(S) Q4.5(D) R12.1 U1.18(SH1) U4.1
M_DIR: STEP.6 STEP1.3
M_EN: STEP.4 STEP1.1
M_STP: STEP.5 STEP1.2
MCU_MOS: DRIVER.7 R126.1
MOS_G: D27.1(C) Q28.3(C) R29.2
MOTOR_EN: MOTOR.5 U1.13(nSLEEP) U6.13(nSLEEP)
PWR_ON: CN16.2 R117.2
R_EN_IN: MOTOR.2 R6.2 U5.9(3A)
R_PH: U5.11(4Y) U6.15(PH)
R_PH_IN: MOTOR.4 R5.2 U5.12(4A)
R_PWM: U5.8(3Y) U6.14(EN)
RA: Q5.1(S) Q5.2(S) Q5.3(S) Q6.5(D) R17.1 U3.2 U6.23(SH2)
RB: Q7.1(S) Q7.2(S) Q7.3(S) Q8.5(D) R20.1 U3.1 U6.18(SH1)
WATER1: D29.1(C) DRIVER.1 R105.1
WATER2: D30.1(C) DRIVER.2 R95.1
$1N1557: LED1.2(A) R28.1
$1N3488: C13.1 U1.6(VREF) U1.7(AVDD) U1.12(IDRIVE)
$1N3491: C5.1 U1.4(CPL)
$1N3492: C7.2 C8.2 C11.2 D1.1(C) U1.1(VM)
$1N3493: C5.2 U1.3(CPH)
$1N3501: D7.1(C) R13.1 U1.19(GL1)
$1N3504: D6.1(C) R11.1 U1.17(GH1)
$1N3505: C11.1 U1.2(VCP)
$1N3628: D2.2(A) Q1.4(G) R7.2 R9.2
$1N3632: D2.1(C) R7.1 U1.24(GH2)
$1N3744: D5.1(C) R8.1 U1.22(GL2)
$1N3746: D5.2(A) Q2.4(G) R8.2 R10.2
$1N4044: D6.2(A) Q3.4(G) R11.2 R12.2
$1N4182: D7.2(A) Q4.4(G) R13.2 R14.2
$1N5157: D8.2(A) Q5.4(G) R15.2 R17.2
$1N5160: D8.1(C) R15.1 U6.24(GH2)
$1N5167: C15.2 C16.2 C17.2 D9.1(C) U6.1(VM)
$1N5169: D11.2(A) Q7.4(G) R19.2 R20.2
$1N5172: D11.1(C) R19.1 U6.17(GH1)
$1N5179: C17.1 U6.2(VCP)
$1N5180: C18.1 U6.4(CPL)
$1N5181: C20.1 U6.8(DVDD)
$1N5183: C19.1 U6.6(VREF) U6.7(AVDD) U6.12(IDRIVE)
$1N5184: C18.2 U6.3(CPH)
$1N5185: D12.1(C) R21.1 U6.19(GL1)
$1N5192: D12.2(A) Q8.4(G) R21.2 R22.2
$1N5224: D10.1(C) R16.1 U6.22(GL2)
$1N5237: D10.2(A) Q6.4(G) R16.2 R18.2
$2N1901: D30.2(A) Q24.1(G) R94.2 R95.2
$2N1904: C120.1 D25.2(A) Q24.3(D) WATER2.3 WATER2.4
$2N1907: D29.2(A) Q23.1(G) R104.2 R105.2
$2N1909: C128.1 D22.2(A) Q23.3(D) WATER1.3 WATER1.4
$2N2685: R25.2 R26.1 U57.2(INA-)
$2N2896: R26.2 R118.2 U57.1(OUTA)
$2N3653: D27.2(A) Q29.1(G) R27.2 R29.1
$2N3846: D28.1(A) Q29.2(D) U54.1 U54.2 U54.3 U54.4
$2N3975: U52.2 U53.1 U53.2 U53.3 U53.4
$2N5962: Q26.1 R126.2 R128.2
$2N6050: Q26.3 R127.1
$2N6056: Q28.1(B) R127.2 R129.1
$2N6342: R130.2 R133.1 U57.6(INB-)
$2N6441: R131.2 R132.2 U57.5(INB+)
$2N6447: R124.2 R133.2 U57.7(OUTB)
$3N725: C139.2 D23.1(K) L5.1 U50.8(PH)
$3N729: C139.1 U50.1(BOOT)
$3N1223: Q22.4(G) R116.2 R117.1
$3N1226: D24.1(K) Q21.1(S) Q21.2(S) Q21.3(S) Q22.1(S) Q22.2(S) Q22.3(S) R115.1 R116.1
$3N1227: D24.2(A) Q21.4(G) R114.2 R115.2
$3N1392: R112.1 R113.2 U50.4(VSENSE)
Net-(LED2-2): LED2.2(A) R91.1

Not connected (* = marked no-connect by the designer): SCREW1 1*; SCREW2 1*; STEP 3*; U1 9(nFAULT)* 10(SNSOUT)* 11(SO)*; U2 4(NC)*; U6 9(nFAULT)* 10(SNSOUT)* 11(SO)*; U50 2(NC)* 3(NC)* 5(ENA)*

## Notes on the sheets
sheet 1
- 左电机驱动
- 电机信号输入
- 电机信号调制
- 右电机驱动
- 电机指示灯
- 电机供电
- 电机输出
sheet 2
- 水泵输出
- 信号输入
- 舵机输出
- 加热输出
- MOS控制
- NTC信号调制
- 0.3V基准电源
- 步进电机
sheet 3
- 防反接/过压保护
- 5V减压
- 3V3减压
